# EAGLE design AdditionalSensor (EAGLE 9.6.2)
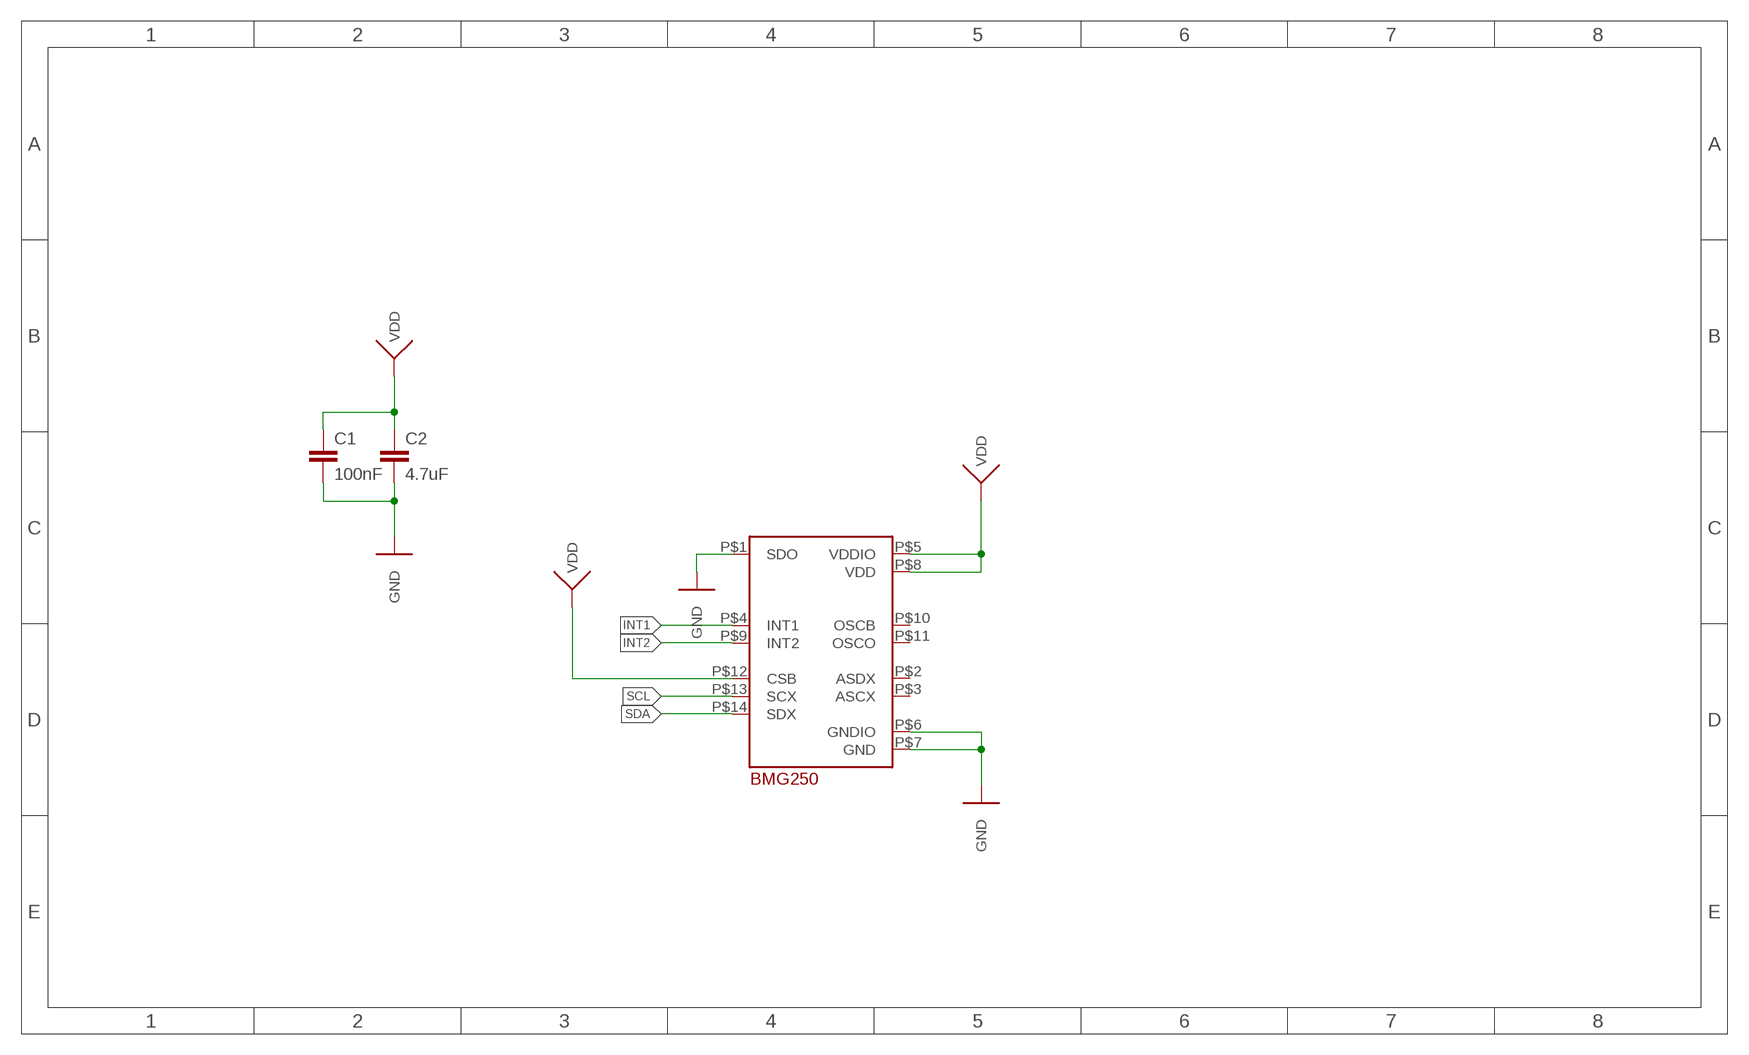
[diagram p0: schematic, sheet 1]

## Parts
C1  100nF  CAPACITOR0603  [C0603]
C2  4.7uF  CAPACITOR0603  [C0603]
U1  BMG250  [LGA14]

## Nets
GND: C1.2 C2.2 U1.P$1(SDO) U1.P$6(GNDIO) U1.P$7(GND)
INT1: U1.P$4(INT1)
INT2: U1.P$9(INT2)
SCL: U1.P$13(SCX)
SDA: U1.P$14(SDX)
VDD: C1.1 C2.1 U1.P$5(VDDIO) U1.P$8(VDD) U1.P$12(CSB)
Unconnected: U1.P$2(ASDX) U1.P$3(ASCX) U1.P$10(OSCB) U1.P$11(OSCO)

## Library data of the parts
C1 C2 = Passives:CAPACITOR: Capacitor
U1 = Gyroscopes:BMG250

## Board
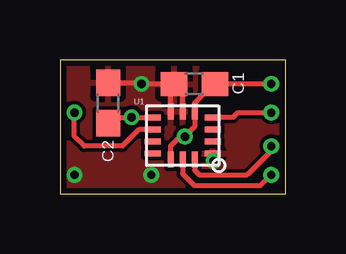
[diagram p1: board, top side]
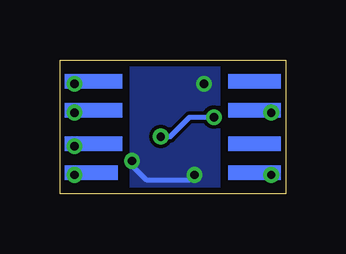
[diagram p2: board, bottom side, seen from below]

Size 9.4 x 5.6 mm. Coordinates in mm from the lower left corner, seen from the top.
Outline: 0,0 9.4,0 9.4,5.6 0,5.6 0,0
Copper layers (1*16): Top 0.035mm / dielectric 1.5mm / Bottom 0.035mm
Design rules "SeeedStudio_2layer_DRU_no_angle_20140221": minimum track width 6mil, minimum drill 12mil, track to track 6mil, track to pad 6mil, pad to pad 6mil, via to via 6mil, smd to smd 0mil, copper to edge 10mil, drill to drill 10mil, minimum pad ring 10mil, minimum via ring 6mil, stop-mask expansion 2mil, vias tented up to drill 100mil, thermal gap 10mil

### Footprints (pad centres in the part's own frame; a part is rotated, then mirrored left to right if it is on the bottom)
C0603 = smd 1.1 x 1: 1 -0.85,0; 2 0.85,0
LGA14 = smd 0.675 x 0.25: P$1 -1.25,0.75; P$2 -1.25,0.25; P$3 -1.25,-0.25; P$4 -1.25,-0.75; P$8 1.25,-0.75; P$9 1.25,-0.25; P$10 1.25,0.25; P$11 1.25,0.75 | smd 0.25 x 0.675: P$5 -0.5,-1; P$6 0,-1; P$7 0.5,-1; P$12 0.5,1; P$13 0,1; P$14 -0.5,1

### Placement (x,y rotation side)
C1  5.6,4.6 180 top
C2  2,3.8 90 top
U1  5.11,2.44 180 top

### Tracks (layer width: path | path; a pad name or v marks a point on that pad's centre or on a via)
GND  (via drill 0.35)
  Top 0.2: U1.P$7 4.61,4.46 C1.2 | U1.P$6 5.11,4.24 C1.2 | C2.2 3.35,4.65 v3.4,4.6 C1.2 | U1.P$1 6.4,1.65 v6.4,1.38
  Bottom 0.2: v6.4,1.38 6.4,1.2 5.8,0.6 4,0.6 v3.8,0.8
  other vias: 0.6,0.8
  pour Bottom: 2.8,5.8 6.4,5.8 6.4,-0.2 2.8,-0.2
  pour Top: -0.6,6 10.2,6 10.2,-0.6 -0.6,-0.6
INT1  (via drill 0.35)
  Top 0.2: U1.P$4 7.2,3.2 7.4,3.4 v8.8,3.4
INT2  (via drill 0.35)
  Top 0.2: U1.P$9 3.29,2.69 2.6,2 1,2 0.6,2.4 v0.6,3.4
SCL  (via drill 0.35)
  Top 0.2: U1.P$13 5.11,0.84 5.6,0.35 8.35,0.35 v8.8,0.8
SDA  (via drill 0.35)
  Top 0.2: U1.P$14 5.61,0.99 5.8,0.8 7.8,0.8 8.8,1.8 v8.8,2
VDD  (via drill 0.35)
  Top 0.2: C2.1 2.24,3.19 v3,3.19 | v3,3.19 U1.P$8 | v8.8,4.6 C1.1 6.4,4.6 5.61,3.81 U1.P$5 5.61,2.81 v5.2,2.4 5,2.4 4.61,2.01 U1.P$12 | v2.99,3.21 v3,3.19
  Bottom 0.2: v5.2,2.4 4.8,2.4 4,3.21 v2.99,3.21
(copper drawn outside any net)
  shapes: Bottom area x8